# EAGLE design arduino_uno_shield (EAGLE 7.5.0)
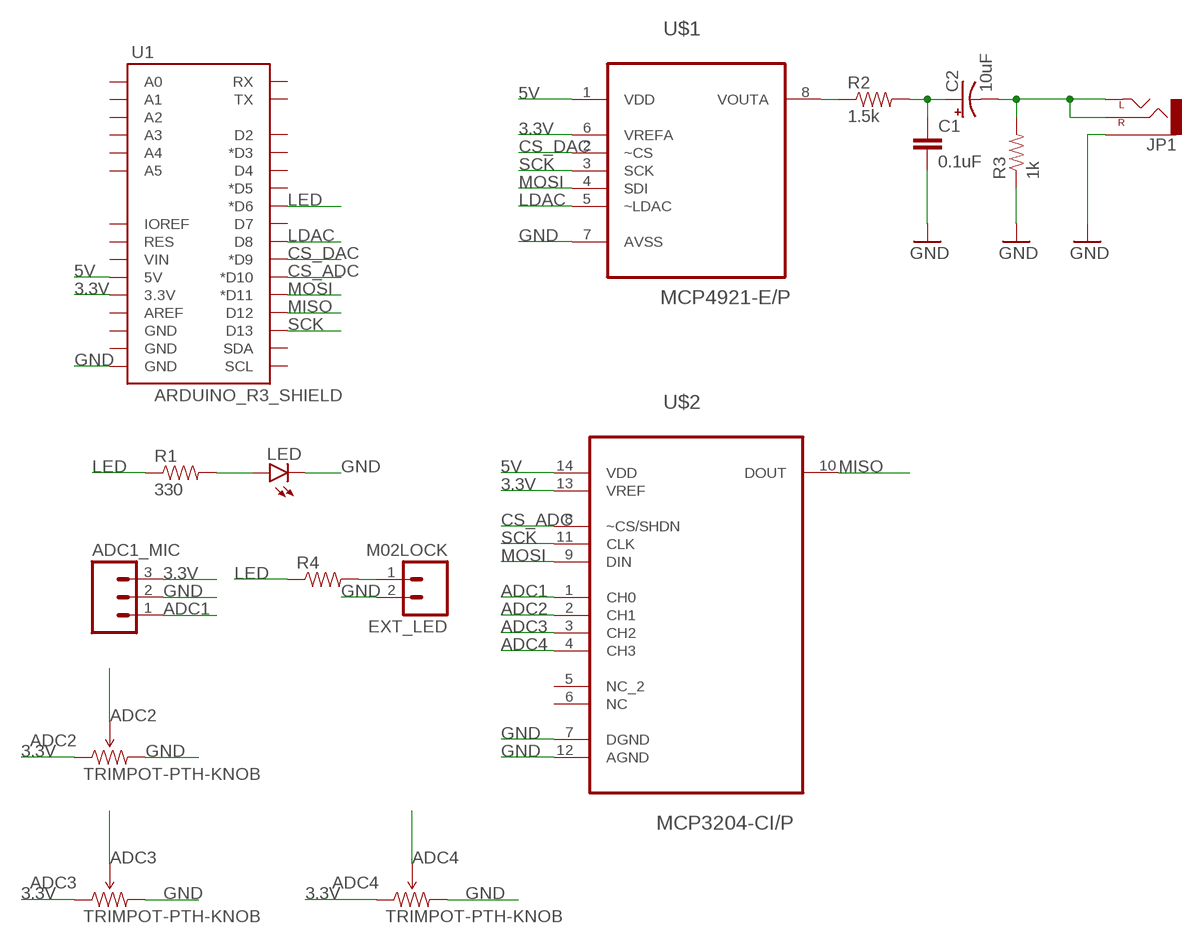
[diagram p0: schematic, sheet 1]

## Parts
ADC1_MIC  M03LOCK  [1X03_LOCK]
ADC2  TRIMPOT-PTH-KNOB  [3386U]
ADC3  TRIMPOT-PTH-KNOB  [3386U]
ADC4  TRIMPOT-PTH-KNOB  [3386U]
C1  0.1uF  CAPPTH1  [CAP-PTH-5MM]
C2  10uF  CAP_POLPTH2  [CPOL-RADIAL-10UF-25V]
EXT_LED  M02LOCK  [1X02_LOCK]
JP1  AUDIO-JACKPTH  [AUDIO-JACK]
LED  LED5MM  [LED5MM]
R1  330  RESISTORPTH-1/4W  [AXIAL-0.4]
R2  1.5k  RESISTORPTH-1/4W  [AXIAL-0.4]
R3  1k  RESISTORPTH-1/4W  [AXIAL-0.4]
R4  RESISTORPTH-1/4W  [AXIAL-0.4]
U1  ARDUINO_R3_SHIELD  [UNO_R3_SHIELD]
U$1  MCP4921-E/P  [DIP254P762X432-8]
U$2  MCP3204-CI/P  [DIP254P762X432-14]

## Nets
3.3V: ADC1_MIC.3 ADC2.1(CCW) ADC3.1(CCW) ADC4.1(CCW) U1.3.3V U$1.6(VREFA) U$2.13(VREF)
5V: U1.5V U$1.1(VDD) U$2.14(VDD)
ADC1: ADC1_MIC.1 U$2.1(CH0)
ADC2: ADC2.2(WIPER) U$2.2(CH1)
ADC3: ADC3.2(WIPER) U$2.3(CH2)
ADC4: ADC4.2(WIPER) U$2.4(CH3)
CS_ADC: U1.D10(*D10) U$2.8(~CS/SHDN)
CS_DAC: U1.D9(*D9) U$1.2(~CS)
GND: ADC1_MIC.2 ADC2.3(CW) ADC3.3(CW) ADC4.3(CW) C1.2 EXT_LED.2 JP1.SLEEVE LED.K(C) R3.P$1 U1.GND@0(GND) U$1.7(AVSS) U$2.7(DGND) U$2.12(AGND)
LDAC: U1.D8 U$1.5(~LDAC)
LED: R1.P$1 R4.P$1 U1.D6(*D6)
MISO: U1.D12 U$2.10(DOUT)
MOSI: U1.D11(*D11) U$1.4(SDI) U$2.9(DIN)
N$1: LED.A R1.P$2
N$2: R2.P$1 U$1.8(VOUTA)
N$3: C1.1 C2.1(+) R2.P$2
N$4: C2.2(-) JP1.RING(RIGHT) JP1.TIP(LEFT) R3.P$2
N$5: EXT_LED.1 R4.P$2
SCK: U1.D13 U$1.3(SCK) U$2.11(CLK)
Unconnected: U1.A0 U1.A1 U1.A2 U1.A3 U1.A4 U1.A5 U1.AREF U1.D2 U1.D3(*D3) U1.D4 U1.D5(*D5) U1.D7 U1.GND@1(GND) U1.GND@2(GND) U1.IOREF U1.RES U1.RX U1.SCL U1.SDA U1.TX U1.VIN U$2.5(NC_2) U$2.6(NC)

## Library data of the parts
ADC1_MIC = SparkFun-Connectors:M03: Header 3 Standard 3-pin 0.1" header. Use with straight break away headers (SKU : PRT-00116), right angle break away headers (PRT-00553), swiss pins (PRT-00743), machine pins (PRT-00117), and female headers (PRT-00115). Molex polarized connector foot print use with SKU : PRT-08232 with associated crimp pins and housings.
ADC2-ADC4 = SparkFun-Electromechanical:TRIMPOT: Various small potentiometers for "set-and-forget" applications
C1 = SparkFun-Capacitors:CAP: Capacitor Standard 0603 ceramic capacitor, and 0.1" leaded capacitor.
C2 = SparkFun-Capacitors:CAP_POL: Capacitor Polarized These are standard SMD and PTH capacitors. Normally 10uF, 47uF, and 100uF in electrolytic and tantalum varieties. Always verify the external diameter of the through hole cap, it varies with capacity, voltage, and manufacturer. The EIA devices should be standard.
EXT_LED = SparkFun-Connectors:M02: Standard 2-pin 0.1" header. Use with - straight break away headers ( PRT-00116) - right angle break away headers (PRT-00553) - swiss pins (PRT-00743) - machine pins (PRT-00117) - female headers (PRT-00115) Molex polarized connector foot print use with: PRT-08233 with associated crimp pins and housings. 2.54_SCREWTERM for use with PRT-10571. 3.5mm Screw Terminal footprints for PRT-08084 5mm Screw Terminal footprints for use with PRT-08432
JP1 = SparkFun-Connectors:AUDIO-JACK: 3.5mm Audio Jack Simple 3.5mm common PCB mount audio jack. SKU: PRT-08032
LED = SparkFun-LED:LED: LEDs Standard schematic elements and footprints for 5mm, 3mm, 1206, and 0603 sized LEDs. 5mm - Spark Fun Electronics SKU : COM-00529 (and others)
R1-R4 = SparkFun-Resistors:RESISTOR: Resistor Basic schematic elements and footprints for 0603, 1206, and PTH resistors.
U1 = SparkFun-Boards:ARDUINO_R3_SHIELD: Shield form compatible with the Arduino Uno R3.
U$1 = Microchip_By_element14_Batch_1:MCP4921-E/P: DAC; MPN: MCP4921-E/P; OC_FARNELL: 1332112; OC_NEWARK: 08J8743; PACKAGE: DIP-8; SUPPLIER: Microchip
U$2 = Microchip_By_element14_Batch_1:MCP3204-CI/P: A/D Converters; MPN: MCP3204-CI/P; OC_FARNELL: 9758593; OC_NEWARK: 19C7209; PACKAGE: DIP-14; SUPPLIER: Microchip

## Board
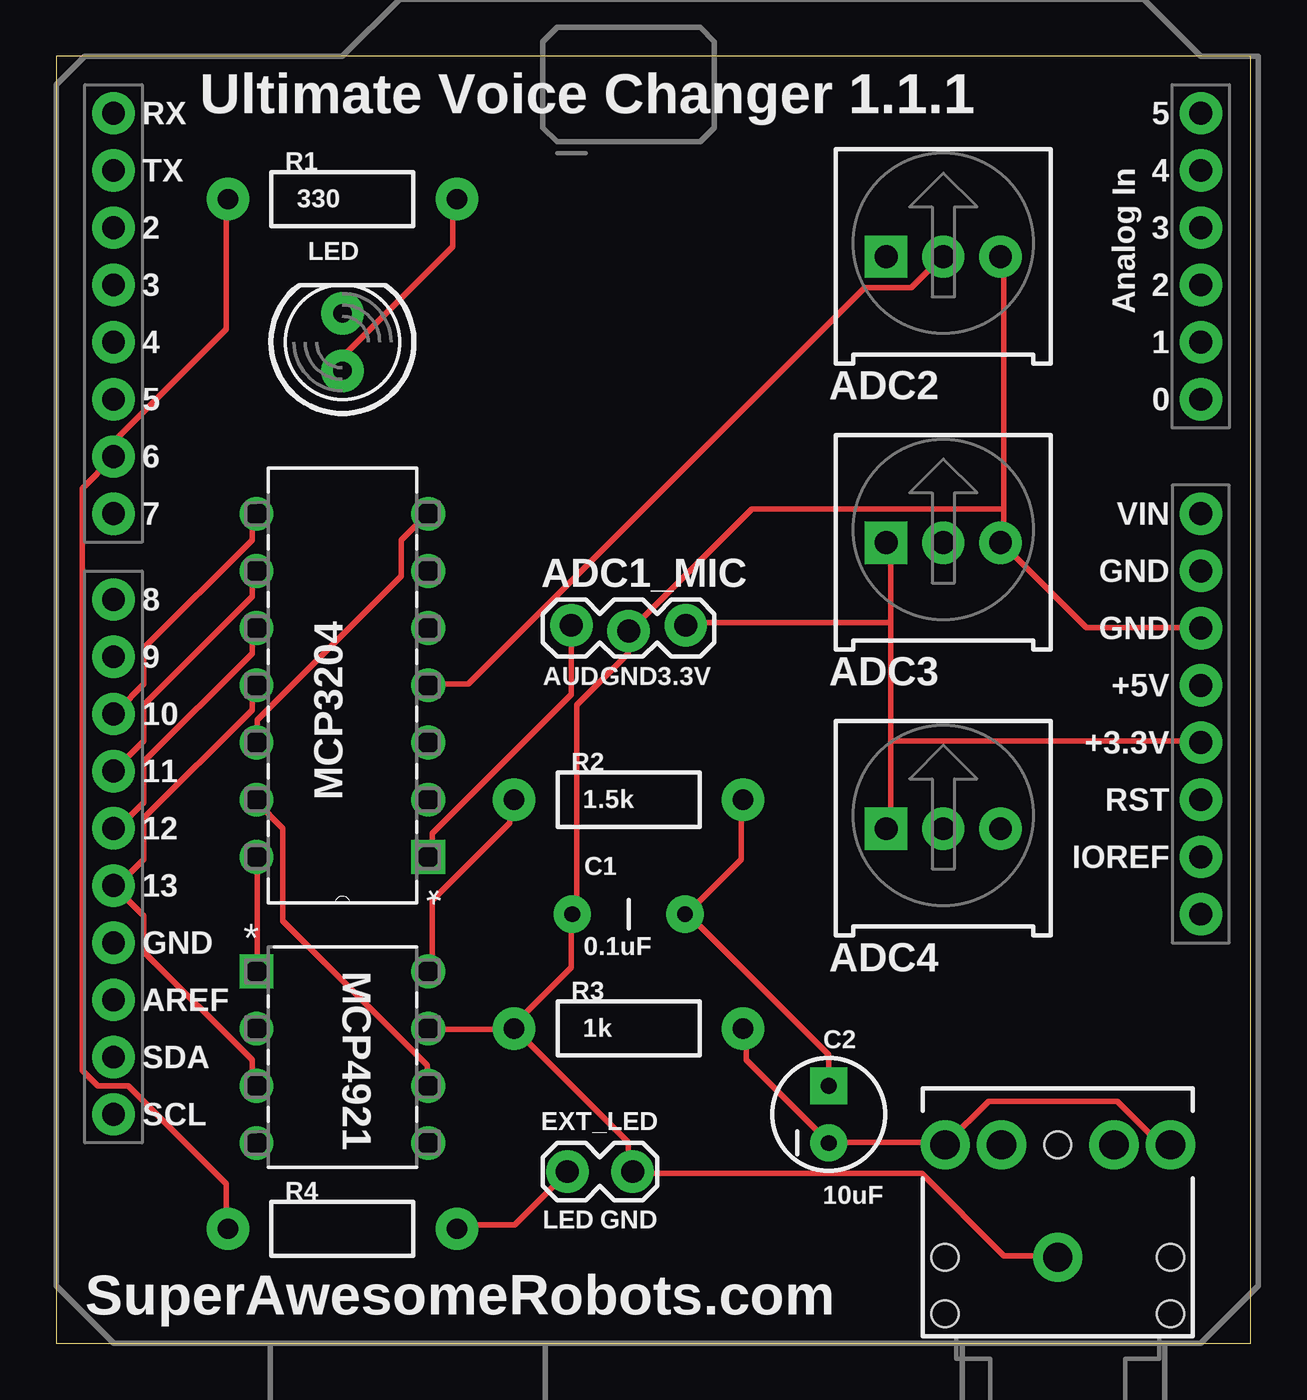
[diagram p1: board, top side]
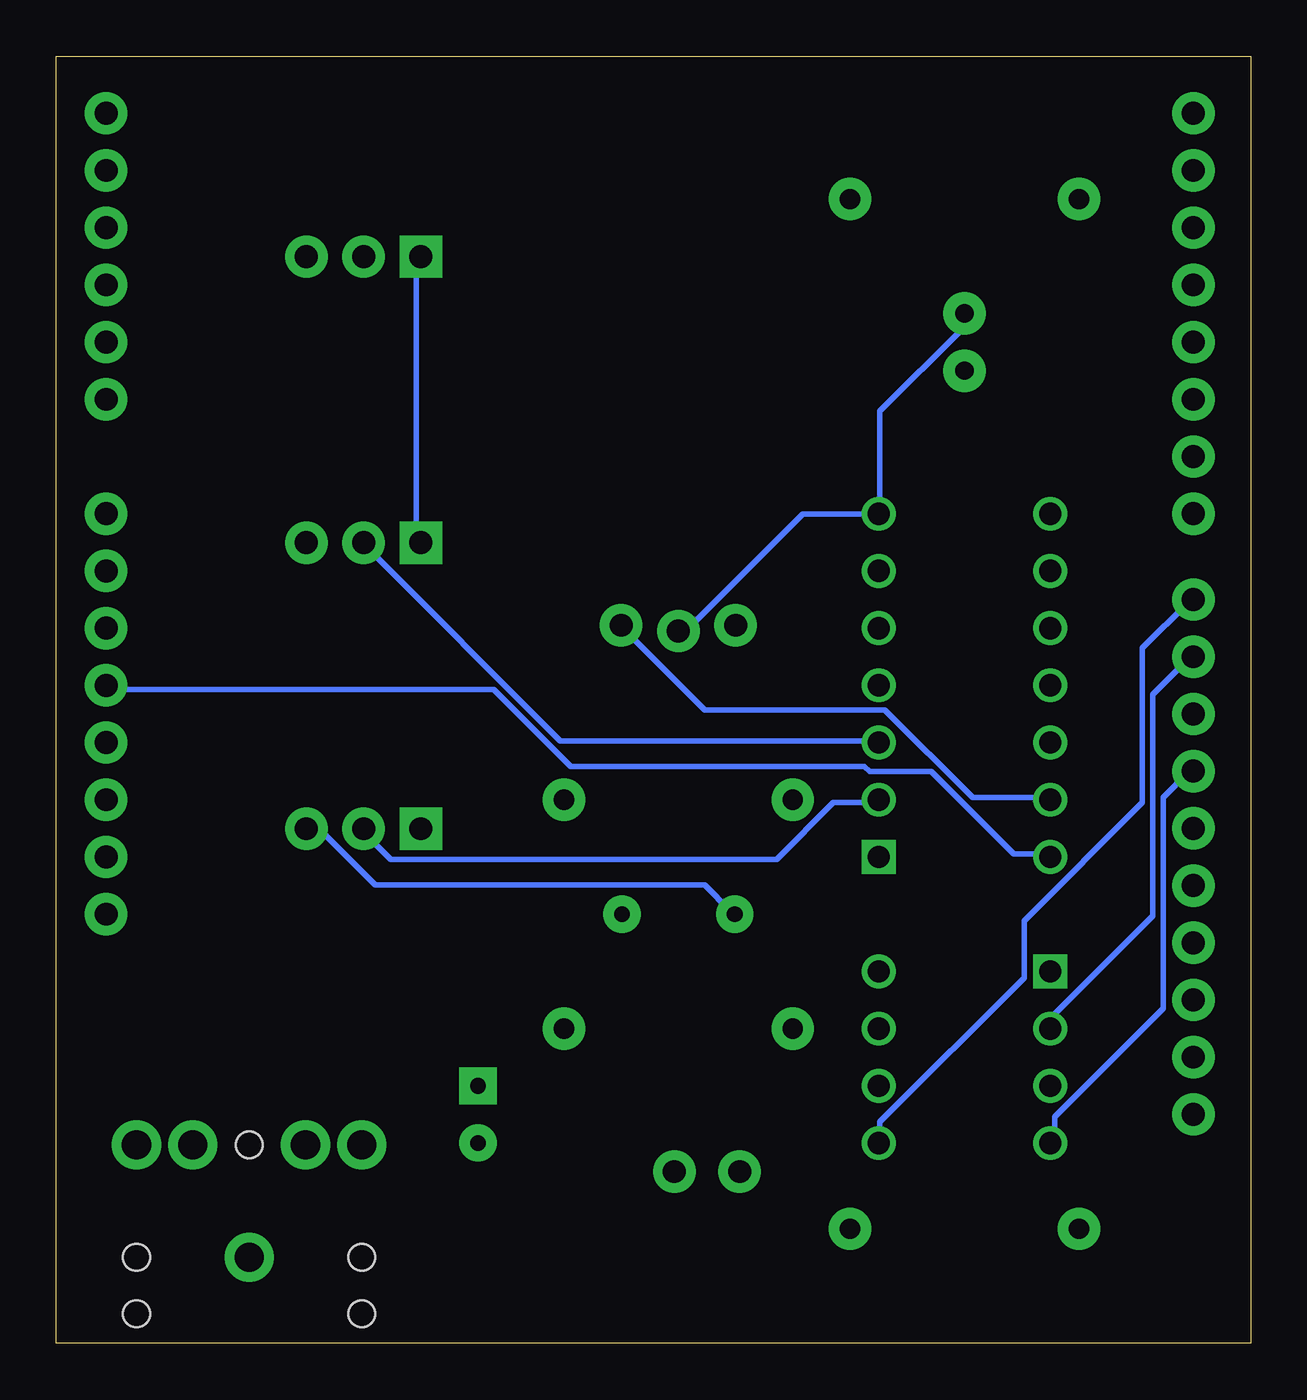
[diagram p2: board, bottom side, seen from below]

Size 53.01 x 57.14 mm. Coordinates in mm from the lower left corner, seen from the top.
Outline: 0,0 53.01,0 53.01,57.14 0,57.14 0,0
Copper layers (1*16): Top 0.035mm / dielectric 1.5mm / Bottom 0.035mm
Design rules "default": minimum track width 10mil, minimum drill 24mil, track to track 8mil, track to pad 8mil, pad to pad 8mil, via to via 8mil, smd to smd 8mil, copper to edge 40mil, drill to drill 8mil, minimum pad ring 10mil, minimum via ring 8mil, stop-mask expansion 4mil, vias tented up to drill 0mil, thermal gap 10mil

### Footprints (pad centres in the part's own frame; a part is rotated, then mirrored left to right if it is on the bottom)
1X03_LOCK = drill 1.016 pad 1.88: 1 0,0.127; 2 2.54,-0.127; 3 5.08,0.127
3386U = drill 1.016 pad 1.88 square: 1 -2.54,-0.015 | drill 1.016 pad 1.88: 2 0,-0.015; 3 2.54,-0.015
CAP-PTH-5MM = drill 0.7 pad 1.651: 1 -2.5,0; 2 2.5,0
CPOL-RADIAL-10UF-25V = drill 0.7 pad 1.651 square: 1 1.27,0 | drill 0.7 pad 1.651: 2 -1.27,0
1X02_LOCK = drill 1.016 pad 1.88: 1 -0.178,0; 2 2.718,0
AUDIO-JACK = drill 1.3 pad 2.184: RING 5,5; RSH 5,2.5; SLEEVE 0,0; TIP 5,-5; TSH 5,-2.5 | hole 1.2: 0,5; -2.5,5; -2.5,-5; 0,-5; 5,0
LED5MM = drill 0.813 pad 1.88: A -1.27,0; K 1.27,0
AXIAL-0.4 = drill 0.9 pad 1.88: P$1 -5.08,0; P$2 5.08,0
UNO_R3_SHIELD = drill 1.016 pad 1.88: 3.3V 50.8,26.67; 5V 50.8,29.21; A0 50.8,41.91; A1 50.8,44.45; A2 50.8,46.99; A3 50.8,49.53; A4 50.8,52.07; A5 50.8,54.61; AREF 2.54,15.24; D2 2.54,49.53; D3 2.54,46.99; D4 2.54,44.45; D5 2.54,41.91; D6 2.54,39.37; D7 2.54,36.83; D8 2.54,33.02; D9 2.54,30.48; D10 2.54,27.94; D11 2.54,25.4; D12 2.54,22.86; D13 2.54,20.32; GND@0 50.8,31.75; GND@1 50.8,34.29; GND@2 2.54,17.78; IOREF 50.8,21.59; NC 50.8,19.05; RES 50.8,24.13; RX 2.54,54.61; SCL 2.54,10.16; SDA 2.54,12.7; TX 2.54,52.07; VIN 50.8,36.83
DIP254P762X432-8 = drill 0.991 square: 1 -7.62,7.62 | drill 0.991: 2 -7.62,5.08; 3 -7.62,2.54; 4 -7.62,0; 5 0,0; 6 0,2.54; 7 0,5.08; 8 0,7.62
DIP254P762X432-14 = drill 0.991 square: 1 -7.62,15.24 | drill 0.991: 2 -7.62,12.7; 3 -7.62,10.16; 4 -7.62,7.62; 5 -7.62,5.08; 6 -7.62,2.54; 7 -7.62,0; 8 0,0; 9 0,2.54; 10 0,5.08; 11 0,7.62; 12 0,10.16; 13 0,12.7; 14 0,15.24

### Placement (x,y rotation side)
ADC1_MIC  22.86,31.75 0 top
ADC2  39.37,22.86 0 top
ADC3  39.37,35.56 0 top
ADC4  39.37,48.26 0 top
C1  25.4,19.05 180 top
C2  34.29,10.16 90 top
EXT_LED  22.86,7.62 0 top
JP1  44.45,3.81 90 top
LED  12.7,44.45 90 top
R1  12.7,50.8 0 top
R2  25.4,24.13 0 top
R3  25.4,13.97 0 top
R4  12.7,5.08 0 top
U1  0,0 0 top
U$1  16.51,8.89 0 top
U$2  8.89,36.83 180 top

### Tracks (layer width: path | path; a pad name or v marks a point on that pad's centre or on a via)
3.3V
  Top 0.254: U$1.6 16.46,11.43 16.46,12.34 10.06,18.75 10.06,22.86 8.91,24 U$2.13 | 37.03,32 37.03,35.43 ADC3.1 | 37.03,32 37.03,26.75 | 37.03,26.75 37.03,22.86 ADC2.1 | 37.03,32 28.12,32 ADC1_MIC.3 | 37.03,26.75 50.75,26.75 U1.3.3V
  Bottom 0.254: ADC4.1 37.03,48.23 37.03,35.66 ADC3.1 | U$2.13 8.91,24.23 12.34,24.23 16.23,28.12 24.23,28.12 27.89,31.77 ADC1_MIC.3
5V
  Top 0.254: U$1.1 8.91,16.69 8.91,21.49 U$2.14
  Bottom 0.254: U1.5V 50.75,29.03 33.6,29.03 30.18,25.6 17.14,25.6 16.92,25.38 14.17,25.38 10.52,21.72 8.91,21.72 U$2.14
ADC1
  Top 0.254: ADC1_MIC.1 22.86,28.8 16.69,22.63 16.69,21.72 U$2.1
ADC2
  Bottom 0.254: U$2.2 16.69,24 18.52,24 21.03,21.49 38.18,21.49 39.32,22.63 ADC2.2
ADC3
  Bottom 0.254: U$2.3 16.69,26.75 30.63,26.75 39.32,35.43 ADC3.2
ADC4
  Top 0.254: U$2.4 16.69,29.26 18.29,29.26 35.89,46.86 37.95,46.86 39.32,48.23 ADC4.2
CS_ADC
  Top 0.254: U$2.8 8.69,36.8 8.69,35.66 3.89,30.86 3.89,29.26 2.74,28.12 U1.D10
CS_DAC
  Bottom 0.254: U$1.2 8.69,14.17 8.69,14.63 4.34,18.97 4.34,28.8 2.74,30.4 U1.D9
GND
  Top 0.254: U$1.7 16.69,13.95 20.12,13.95 R3.P$1 | R3.P$1 20.34,14.17 22.86,16.69 22.86,18.97 C1.2 23.09,19.2 23.09,28.35 25.38,30.63 25.38,31.55 ADC1_MIC.2 25.6,31.77 30.86,37.03 42.06,37.03 | R3.P$1 25.38,8.91 25.38,7.77 EXT_LED.2 25.6,7.54 38.41,7.54 42.06,3.89 44.35,3.89 JP1.SLEEVE | U1.GND@0 50.75,31.77 45.72,31.77 42.06,35.43 ADC3.3 42.06,35.66 42.06,37.03 | 42.06,37.03 42.06,48.23 ADC4.3 | U$2.12 8.91,26.75 8.91,27.66 15.32,34.06 15.32,35.66 16.46,36.8 U$2.7
  Bottom 0.254: ADC2.3 41.83,22.63 41.15,22.63 38.86,20.34 24.23,20.34 23.09,19.2 C1.2 | ADC1_MIC.2 25.38,31.77 24.92,31.77 19.89,36.8 16.69,36.8 U$2.7 16.46,37.03 16.46,41.38 12.8,45.03 12.8,45.72 LED.K
LDAC
  Bottom 0.254: U$1.5 16.46,8.91 16.46,9.83 10.06,16.23 10.06,18.75 4.8,24 4.8,30.86 2.74,32.92 U1.D8
LED
  Top 0.254: R1.P$1 7.54,50.75 7.54,45.03 2.74,40.23 2.74,39.55 U1.D6 2.52,39.32 1.14,37.95 1.14,12.12 1.83,11.43 3.2,11.43 7.54,7.09 7.54,5.26 R4.P$1
MISO
  Top 0.254: U$2.10 8.69,31.55 8.69,30.63 3.89,25.83 3.89,24 2.74,22.86 U1.D12
MOSI
  Top 0.254: U1.D11 3.89,26.75 3.89,28.35 8.69,33.15 8.69,34.29 U$2.9
  Bottom 0.254: U$1.4 8.69,8.91 8.69,10.06 3.89,14.86 3.89,24.23 2.74,25.38 U1.D11
N$1
  Top 0.254: LED.A 12.8,43.2 12.8,43.89 17.6,48.69 17.6,50.75 R1.P$2
N$2
  Top 0.254: U$1.8 16.69,16.69 16.69,19.66 20.12,23.09 20.12,24 R2.P$1
N$3
  Top 0.254: C2.1 34.29,12.8 28.12,18.97 C1.1 28.12,19.2 30.4,21.49 30.4,24 R2.P$2
N$4
  Top 0.254: 34.29,8.91 39.32,8.91 JP1.RING 39.55,8.91 41.38,10.74 47.09,10.74 48.92,8.91 49.38,8.91 JP1.TIP | 34.29,8.91 30.63,12.57 30.63,13.95 R3.P$2 | 34.29,8.91 C2.2
N$5
  Top 0.254: R4.P$2 17.83,5.26 20.34,5.26 22.63,7.54 EXT_LED.1
SCK
  Top 0.254: U$1.3 8.69,11.43 8.69,12.57 3.89,17.37 3.89,18.97 U1.D13 2.74,20.34 3.89,21.49 3.89,23.32 8.69,28.12 8.69,29.03 U$2.11

### Text on the board
tPlace: Ultimate Voice Changer 1.1.1 | ADC2 | AUD | GND | 3.3V | ADC3 | MCP3204 | MCP4921 | ADC4 | LED | GND | SuperAwesomeRobots.com